# Altium schematic sheet Power.SchDoc: Power
size A3; Date: JUN 2020; ApprovedBy: Hören; CheckedBy: Mörz; Author: Hören; DrawnBy: Rudziński; Engineer: Hören; Organization: Semi-ATE; SheetNumber: 2; SheetTotal: 7
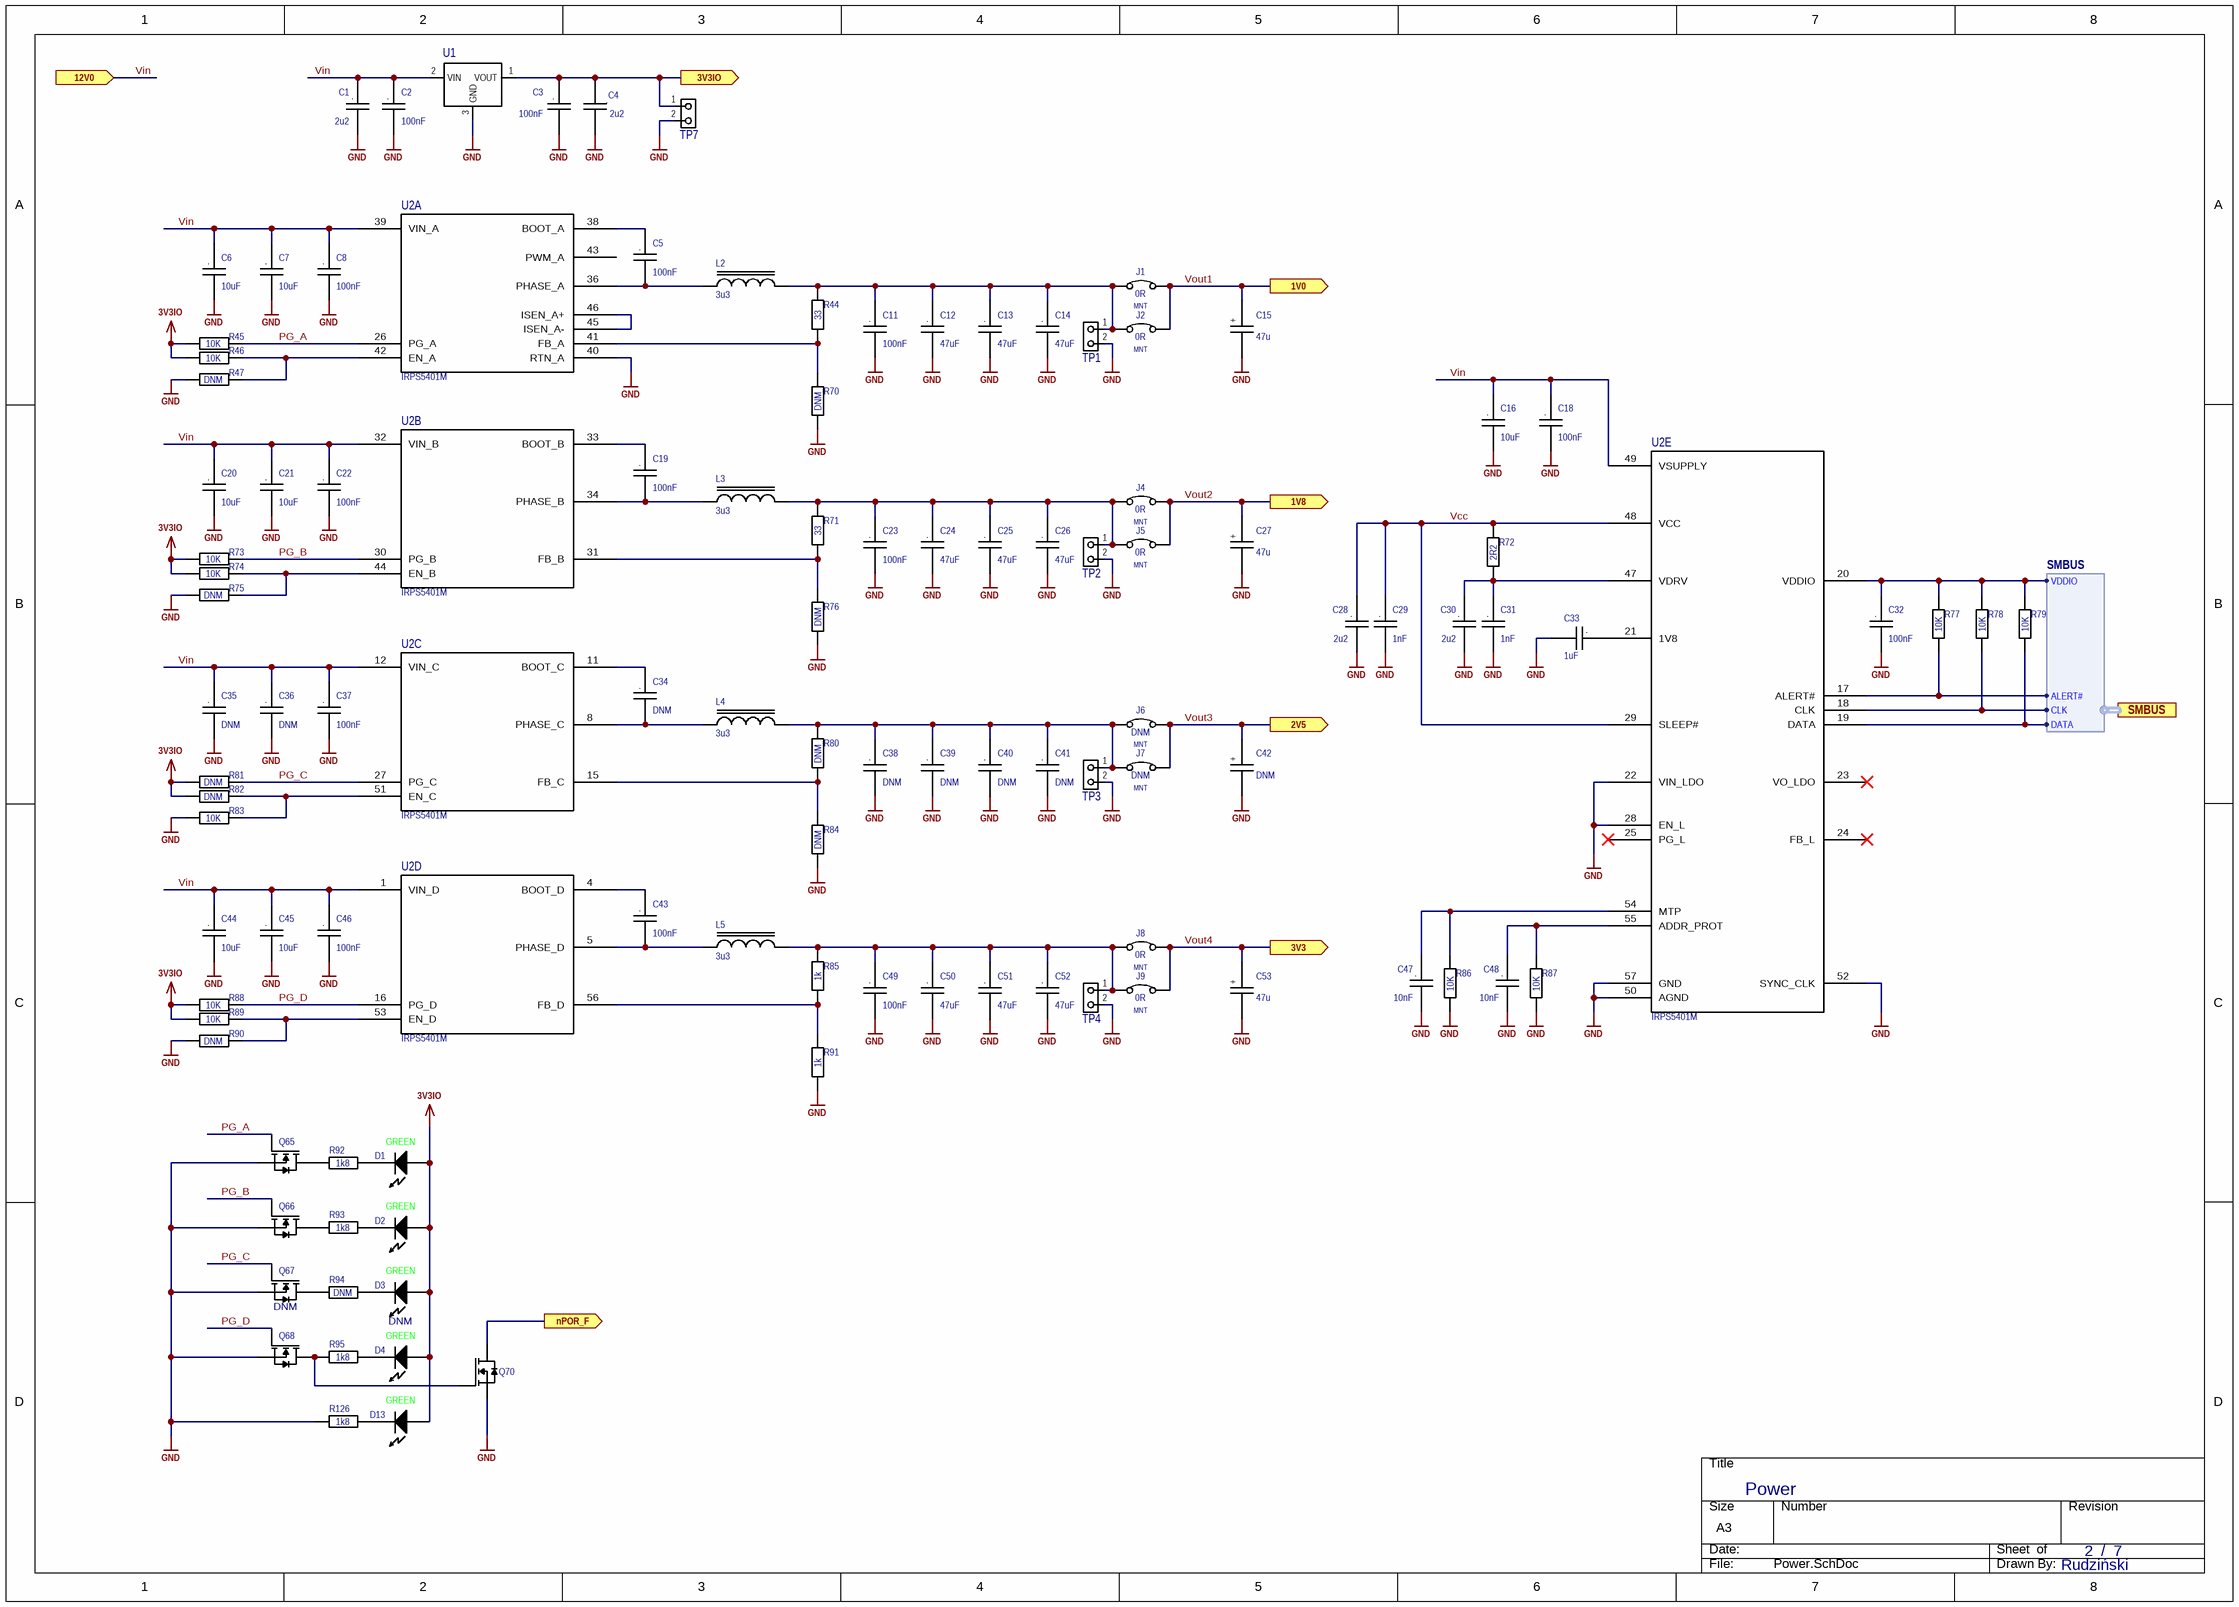
[diagram p0: Power.SchDoc]

## Parts
C1  value 2u2  [C0805 Reflow]  (hidden comment: C)
C2  value 100nF  [C0402 Reflow]  (hidden comment: C)
C3  value 100nF  [C0402 Reflow]  (hidden comment: C)
C4  value 2u2  [C0805 Reflow]  (hidden comment: C)
C5  value 100nF  [C0402 Reflow]  (hidden comment: C)
C6  value 10uF  [C1206 Reflow]  (hidden comment: C)
C7  value 10uF  [C1206 Reflow]  (hidden comment: C)
C8  value 100nF  [C0402 Reflow]  (hidden comment: C)
C11  value 100nF  [C0402 Reflow]  (hidden comment: C)
C12  value 47uF  [C1210 Reflow]  (hidden comment: C)
C13  value 47uF  [C1210 Reflow]  (hidden comment: C)
C14  value 47uF  [C1210 Reflow]  (hidden comment: C)
C15  value 47u  [CAP_TAN_B]  (hidden comment: C+)
C16  value 10uF  [C1206 Reflow]  (hidden comment: C)
C18  value 100nF  [C0402 Reflow]  (hidden comment: C)
C19  value 100nF  [C0402 Reflow]  (hidden comment: C)
C20  value 10uF  [C1206 Reflow]  (hidden comment: C)
C21  value 10uF  [C1206 Reflow]  (hidden comment: C)
C22  value 100nF  [C0402 Reflow]  (hidden comment: C)
C23  value 100nF  [C0402 Reflow]  (hidden comment: C)
C24  value 47uF  [C1210 Reflow]  (hidden comment: C)
C25  value 47uF  [C1210 Reflow]  (hidden comment: C)
C26  value 47uF  [C1210 Reflow]  (hidden comment: C)
C27  value 47u  [CAP_TAN_B]  (hidden comment: C+)
C28  value 2u2  [C0805 Reflow]  (hidden comment: C)
C29  value 1nF  [C0402 Reflow]  (hidden comment: C)
C30  value 2u2  [C0805 Reflow]  (hidden comment: C)
C31  value 1nF  [C0402 Reflow]  (hidden comment: C)
C32  value 100nF  [C0402 Reflow]  (hidden comment: C)
C33  value 1uF  [C0402 Reflow]  (hidden comment: C)
C34  value DNM  [C0402 Reflow]  (hidden comment: C)  (no BOM)
C35  value DNM  [C1206 Reflow]  (hidden comment: C)  (no BOM)
C36  value DNM  [C1206 Reflow]  (hidden comment: C)  (no BOM)
C37  value 100nF  [C0402 Reflow]  (hidden comment: C)
C38  value DNM  [C0402 Reflow]  (hidden comment: C)  (no BOM)
C39  value DNM  [C1210 Reflow]  (hidden comment: C)  (no BOM)
C40  value DNM  [C1210 Reflow]  (hidden comment: C)  (no BOM)
C41  value DNM  [C1210 Reflow]  (hidden comment: C)  (no BOM)
C42  value DNM  [CAP_TAN_B]  (hidden comment: C+)  (no BOM)
C43  value 100nF  [C0402 Reflow]  (hidden comment: C)
C44  value 10uF  [C1206 Reflow]  (hidden comment: C)
C45  value 10uF  [C1206 Reflow]  (hidden comment: C)
C46  value 100nF  [C0402 Reflow]  (hidden comment: C)
C47  value 10nF  [C0402 Reflow]  (hidden comment: C)
C48  value 10nF  [C0402 Reflow]  (hidden comment: C)
C49  value 100nF  [C0402 Reflow]  (hidden comment: C)
C50  value 47uF  [C1210 Reflow]  (hidden comment: C)
C51  value 47uF  [C1210 Reflow]  (hidden comment: C)
C52  value 47uF  [C1210 Reflow]  (hidden comment: C)
C53  value 47u  [CAP_TAN_B]  (hidden comment: C+)
D1  Color: GREEN  [L0603G]  (hidden comment: D)
D2  Color: GREEN  [L0603G]  (hidden comment: D)
D3  Color: GREEN  NicName: DNM  [L0603G]  (hidden comment: D)  (no BOM)
D4  Color: GREEN  [L0603G]  (hidden comment: D)
D13  Color: GREEN  [L0603G]  (hidden comment: D)
J1  value 0R  POPULATED: MNT  [JumperSMD]  (hidden comment: J)  (no BOM)
J2  value 0R  POPULATED: MNT  [JumperSMD]  (hidden comment: J)  (no BOM)
J4  value 0R  POPULATED: MNT  [JumperSMD]  (hidden comment: J)  (no BOM)
J5  value 0R  POPULATED: MNT  [JumperSMD]  (hidden comment: J)  (no BOM)
J6  value DNM  POPULATED: MNT  [JumperSMD]  (hidden comment: J)  (no BOM)
J7  value DNM  POPULATED: MNT  [JumperSMD]  (hidden comment: J)  (no BOM)
J8  value 0R  POPULATED: MNT  [JumperSMD]  (hidden comment: J)  (no BOM)
J9  value 0R  POPULATED: MNT  [JumperSMD]  (hidden comment: J)  (no BOM)
L2  Inductance: 3u3  [XAL4030]  (hidden comment: L)
L3  Inductance: 3u3  [XAL4030]  (hidden comment: L)
L4  Inductance: 3u3  [XAL4030]  (hidden comment: L)  (no BOM)
L5  Inductance: 3u3  [XAL4030]  (hidden comment: L)
Q65  Q  [SOT23-3]  (value not drawn)
Q66  Q  [SOT23-3]  (value not drawn)
Q67  NicName: DNM  [SOT23-3]  (hidden comment: Q)  (no BOM)
Q68  Q  [SOT23-3]  (value not drawn)
Q70  Q  [SOT23-3]  (value not drawn)
R44  value 33  [R0402 Reflow]  (hidden comment: R)
R45  value 10K  [R0402 Reflow]  (hidden comment: R)
R46  value 10K  [R0402 Reflow]  (hidden comment: R)
R47  value DNM  [R0402 Reflow]  (hidden comment: R)  (no BOM)
R70  value DNM  [R0402 Reflow]  (hidden comment: R)  (no BOM)
R71  value 33  [R0402 Reflow]  (hidden comment: R)
R72  value 2R2  [R0402 Reflow]  (hidden comment: R)
R73  value 10K  [R0402 Reflow]  (hidden comment: R)
R74  value 10K  [R0402 Reflow]  (hidden comment: R)
R75  value DNM  [R0402 Reflow]  (hidden comment: R)  (no BOM)
R76  value DNM  [R0402 Reflow]  (hidden comment: R)  (no BOM)
R77  value 10K  [R0402 Reflow]  (hidden comment: R)
R78  value 10K  [R0402 Reflow]  (hidden comment: R)
R79  value 10K  [R0402 Reflow]  (hidden comment: R)
R80  value DNM  [R0402 Reflow]  (hidden comment: R)  (no BOM)
R81  value DNM  [R0402 Reflow]  (hidden comment: R)  (no BOM)
R82  value DNM  [R0402 Reflow]  (hidden comment: R)  (no BOM)
R83  value 10K  [R0402 Reflow]  (hidden comment: R)
R84  value DNM  [R0402 Reflow]  (hidden comment: R)  (no BOM)
R85  value 1k  [R0402 Reflow]  (hidden comment: R)
R86  value 10K  [R0402 Reflow]  (hidden comment: R)
R87  value 10K  [R0402 Reflow]  (hidden comment: R)
R88  value 10K  [R0402 Reflow]  (hidden comment: R)
R89  value 10K  [R0402 Reflow]  (hidden comment: R)
R90  value DNM  [R0402 Reflow]  (hidden comment: R)  (no BOM)
R91  value 1k  [R0402 Reflow]  (hidden comment: R)
R92  value 1k8  [R0603 Reflow]  (hidden comment: R)
R93  value 1k8  [R0603 Reflow]  (hidden comment: R)
R94  value DNM  [R0603 Reflow]  (hidden comment: R)  (no BOM)
R95  value 1k8  [R0603 Reflow]  (hidden comment: R)
R126  value 1k8  [R0603 Reflow]  (hidden comment: R)
TP1  TP  [DualTestpoint 100mils]  (value not drawn)  (no BOM)
TP2  TP  [DualTestpoint 100mils]  (value not drawn)  (no BOM)
TP3  TP  [DualTestpoint 100mils]  (value not drawn)  (no BOM)
TP4  TP  [DualTestpoint 100mils]  (value not drawn)  (no BOM)
TP7  TP  [DualTestpoint 100mils]  (value not drawn)  (no BOM)
U1  U  [SOT23-3]  (value not drawn)
U2  IRPS5401M  [QFN4-7x7-56_IRPS5401M]  (parts A,B,C,D,E of 5)

## Ports
1V0 (out), 1V8 (out), 2V5 (out), 3V3 (out), 3V3IO (out), 12V0 (in), nPOR_F (out), SMBUS (harness SMBUS)

## Harnesses
SMBUS: ALERT#, CLK, DATA, VDDIO

## Nets
3V3IO: D1.1(Anode) D2.1(Anode) D3.1(Anode) D4.1(Anode) D13.1(Anode) R45.2 R46.2 R73.2 R74.2 R81.2 R82.2 R88.2 R89.2
GND: C1.2 C2.2 C3.2 C4.2 C6.2 C7.2 C8.2 C11.2 C12.2 C13.2 C14.2 C15.2 C16.2 C18.2 C20.2 C21.2 C22.2 C23.2 C24.2 C25.2 C26.2 C27.2 C28.2 C29.2 C30.2 C31.2 C32.2 C33.2 C35.2 C36.2 C37.2 C38.2 C39.2 C40.2 C41.2 C42.2 C44.2 C45.2 C46.2 C47.2 C48.2 C49.2 C50.2 C51.2 C52.2 C53.2 Q65.2(S) Q66.2(S) Q67.2(S) Q68.2(S) Q70.2(S) R47.2 R70.1 R75.2 R76.1 R83.2 R84.1 R86.1 R87.1 R90.2 R91.1 R126.1 TP1.2 TP2.2 TP3.2 TP4.2 TP7.2 U1.3(GND) U2.22(VIN_LDO) U2.28(EN_L) U2.40(RTN_A) U2.50(AGND) U2.52(SYNC_CLK) U2.57(GND)
3V3IO: C3.1 C4.1 TP7.1 U1.1(VOUT) ; port 3V3IO  [a separate net that carries the same name]
nPOR_F: Q70.3(D) ; port nPOR_F
PG_A: Q65.1(G) R45.1 U2.26(PG_A)
PG_B: Q66.1(G) R73.1 U2.30(PG_B)
PG_C: Q67.1(G) R81.1 U2.27(PG_C)
PG_D: Q68.1(G) R88.1 U2.16(PG_D)
Vcc: C28.1 C29.1 R72.2 U2.29(SLEEP#) U2.48(VCC)
Vin: C1.1 C2.1 C6.1 C7.1 C8.1 C16.1 C18.1 C20.1 C21.1 C22.1 C35.1 C36.1 C37.1 C44.1 C45.1 C46.1 U1.2(VIN) U2.1(VIN_D) U2.12(VIN_C) U2.32(VIN_B) U2.39(VIN_A) U2.49(VSUPPLY) ; port 12V0
Vout1: C15.1 J1.2 J2.2 ; port 1V0
Vout2: C27.1 J4.2 J5.2 ; port 1V8
Vout3: C42.1 J6.2 J7.2 ; port 2V5
Vout4: C53.1 J8.2 J9.2 ; port 3V3
NetC5_1: C5.1 U2.38(BOOT_A)
NetC5_2: C5.2 L2.1 U2.36(PHASE_A)
NetC11_1: C11.1 C12.1 C13.1 C14.1 J1.1 J2.1 L2.2 R44.2 TP1.1
NetC19_1: C19.1 U2.33(BOOT_B)
NetC19_2: C19.2 L3.1 U2.34(PHASE_B)
NetC23_1: C23.1 C24.1 C25.1 C26.1 J4.1 J5.1 L3.2 R71.2 TP2.1
NetC30_1: C30.1 C31.1 R72.1 U2.47(VDRV)
NetC32_1: C32.1 R77.2 R78.2 R79.2 U2.20(VDDIO) ; port SMBUS.VDDIO
NetC33_1: C33.1 U2.21(1V8)
NetC34_1: C34.1 U2.11(BOOT_C)
NetC34_2: C34.2 L4.1 U2.8(PHASE_C)
NetC38_1: C38.1 C39.1 C40.1 C41.1 J6.1 J7.1 L4.2 R80.2 TP3.1
NetC43_1: C43.1 U2.4(BOOT_D)
NetC43_2: C43.2 L5.1 U2.5(PHASE_D)
NetC47_1: C47.1 R86.2 U2.54(MTP)
NetC48_1: C48.1 R87.2 U2.55(ADDR_PROT)
NetC49_1: C49.1 C50.1 C51.1 C52.1 J8.1 J9.1 L5.2 R85.2 TP4.1
NetD1_2: D1.2(Cathode) R92.2
NetD2_2: D2.2(Cathode) R93.2
NetD3_2: D3.2(Cathode) R94.2
NetD4_2: D4.2(Cathode) R95.2
NetD13_2: D13.2(Cathode) R126.2
NetQ65_3: Q65.3(D) R92.1
NetQ66_3: Q66.3(D) R93.1
NetQ67_3: Q67.3(D) R94.1
NetQ68_3: Q68.3(D) Q70.1(G) R95.1
NetR44_1: R44.1 R70.2 U2.41(FB_A)
NetR46_1: R46.1 R47.1 U2.42(EN_A)
NetR71_1: R71.1 R76.2 U2.31(FB_B)
NetR74_1: R74.1 R75.1 U2.44(EN_B)
NetR77_1: R77.1 U2.17(ALERT#) ; port SMBUS.ALERT#
NetR78_1: R78.1 U2.18(CLK) ; port SMBUS.CLK
NetR79_1: R79.1 U2.19(DATA) ; port SMBUS.DATA
NetR80_1: R80.1 R84.2 U2.15(FB_C)
NetR82_1: R82.1 R83.1 U2.51(EN_C)
NetR85_1: R85.1 R91.2 U2.56(FB_D)
NetR89_1: R89.1 R90.1 U2.53(EN_D)
NetU2_45: U2.45(ISEN_A-) U2.46(ISEN_A+)

Not connected (* = marked no-connect by the designer): U2 23(VO_LDO)* 24(FB_L)* 25(PG_L)* 43(PWM_A)

## Notes on the sheet
- /
- designed by
- reviewed by
- last drawn by
- Project:
- Schematic:
- last printed
- DIN-A3 L
- sheets
- of
- File:
- (in symbol C) .
- (in symbol C+_TAN) +
- (in symbol C_2) .
- (in symbol C_7) .
- (in symbol C_10) .
- (in symbol C_11) .

## Library data of the parts
C1 C4 C28 C30 = C_11: CAP CER 2.2UF 10V X7R 0805; 04. Manufacturer: Samsung Electro-Mechanics; 07. Manufacturer  Part Number: CL21B225KPFNNNE; Tolerance: ±10%; 03. Unit Price: 0.11; Voltage Rating: 10V; Type: X7R; ComponentLink1Description: Info; ComponentLink1URL: https://www.digikey.de/product-detail/en/kemet/C0805C225K8RACTU/399-3522-6-ND/1787578; 02. Distributor Part Number: 1276-1188-1-ND; 09. Operating Temperature: -55°C ~ 125°C; 11. RoHS: YES; 01. Distributor: DigiKey; ComponentLink2Description: DataSheet; ComponentLink2URL: https://content.kemet.com/datasheets/KEM_C1002_X7R_SMD.pdf; Package: 0805
C2 C3 C5 C8 C11 C18 C19 C22 C23 C32 C34 C37 C38 C43 C46 C49 = C: CAP CER 0.1UF 25V X7R 0402; 04. Manufacturer: Yageo; 07. Manufacturer  Part Number: CC0402KRX7R8BB104; Tolerance: ±10%; 03. Unit Price: 0.09; 13. Created Date/Name: AUG2018/Hören; Voltage Rating: 25V; Type: X7R; ComponentLink1Description: Info; ComponentLink1URL: https://www.digikey.de/products/en?keywords=311-2077-6-ND; 02. Distributor Part Number: 311-2077-6-ND; 09. Operating Temperature: -55°C ~ 125°C; 11. RoHS: YES; 01. Distributor: DigiKey; ComponentLink2Description: DataSheet; Package: 0402
C6 C7 C16 C20 C21 C35 C36 C44 C45 = C: CAP CER 10UF 25V X7R 1206; 04. Manufacturer: TDK Corporation; 07. Manufacturer  Part Number: C3216X7R1E106K160AB; Tolerance: ±10%; 03. Unit Price: 0.66; 13. Created Date/Name: AUG2018/Hören; Voltage Rating: 25V; Type: X7R; ComponentLink1Description: Info; ComponentLink1URL: https://www.digikey.de/products/en?keywords=445-7705-6-ND; 02. Distributor Part Number: 445-7705-6-ND; 09. Operating Temperature: -55°C ~ 125°C; 11. RoHS: YES; 01. Distributor: DigiKey; ComponentLink2Description: DataSheet; Package: 1206
C12-C14 C24-C26 C39-C41 C50-C52 = C: CAP CER 47UF 10V X5R 1210; 04. Manufacturer: Samsung Electro-Mechanics; 07. Manufacturer  Part Number: CL32A476MPJNNNE; Tolerance: ±20%; 03. Unit Price: 0.88; 13. Created Date/Name: AUG2018/Hören; Voltage Rating: 10V; Type: X5R; ComponentLink1Description: Info; ComponentLink1URL: *; 02. Distributor Part Number: 1276-3380-6-ND; 09. Operating Temperature: -55°C ~ 85°C; 11. RoHS: YES; 01. Distributor: DigiKey; ComponentLink2Description: DataSheet; Package: 1210
C15 C27 C42 C53 = C+_TAN: CAP TANT 47UF 20% 10V 1411; 04. Manufacturer: AVX Corporation; 07. Manufacturer  Part Number: F971A476MBAHT3; 03. Unit Price: 0.73; 3D-Export: No; ComponentLink1Description: Info; 02. Distributor Part Number: 478-12531-1-ND; 11. RoHS: YES; 01. Distributor: DigiKey; ComponentLink2Description: DataSheet
C29 C31 = C_7: CAP CER 1000PF 25V X7R 0402; 04. Manufacturer: KEMET; 07. Manufacturer  Part Number: C0402C102K3RACTU; Tolerance: ±10%; 03. Unit Price: 0.09; 13. Created Date/Name: AUG2018/Hören; Voltage Rating: 25V; Type: X7R; ComponentLink1Description: Info; ComponentLink1URL: https://www.digikey.de/products/en?keywords=399-1031-6-ND; 02. Distributor Part Number: 399-1031-6-ND; 09. Operating Temperature: -55°C ~ 125°C; 11. RoHS: YES; 01. Distributor: DigiKey; ComponentLink2Description: DataSheet; Package: 0402
C33 = C_2: CAP CER 1UF 6.3V X7R 0402; 04. Manufacturer: Murata Electronics; 07. Manufacturer  Part Number: GRM155R70J105KA12J; Tolerance: ±10%; 03. Unit Price: 0.11; 13. Created Date/Name: AUG2018/Hören; Voltage Rating: 6.3V; Type: X7R; ComponentLink1Description: Info; ComponentLink1URL: https://www.digikey.de/product-detail/en/murata-electronics/GRM155R70J105KA12J/490-13339-6-ND/5973468; 02. Distributor Part Number: 490-13339-6-ND; 09. Operating Temperature: -55°C ~ 125°C; 11. RoHS: YES; 01. Distributor: DigiKey; ComponentLink2Description: DataSheet; Package: 0402
C47 C48 = C_10: CAP CER 0.01UF 25V X7R 0402; 04. Manufacturer: Murata Electronics; 07. Manufacturer  Part Number: GCM155R71E103KA37D; Tolerance: ±10%; 03. Unit Price: 0.09; Voltage Rating: 25V; Type: X7R; ComponentLink1Description: Info; ComponentLink1URL: https://www.digikey.de/product-detail/en/murata-electronics/GCM155R71E103KA37D/490-6043-6-ND/3846259; 02. Distributor Part Number: 490-6043-6-ND; 09. Operating Temperature: -55°C ~ 125°C; 11. RoHS: YES; 01. Distributor: DigiKey; ComponentLink2Description: DataSheet; Package: 0402
D1-D4 D13 = LED: LED GREEN DIFFUSED 0603 SMD; 04. Manufacturer: OSRAM Opto Semiconductors Inc.; 07. Manufacturer  Part Number: LG L29K-G2J1-24-Z; Vf: 1.7V; If: 2mA; Wave Length: 570nm; Viewing Angle: 160°; 03. Unit Price: 0.4; 13. Created Date/Name: AUG2018/Hören; ComponentLink1Description: Info; ComponentLink1URL: https://www.digikey.de/products/en?keywords=475-2709-6-ND; ComponentLink2Description: DataSheet; ComponentLink2URL: https://www.digikey.de/products/en?keywords=475-2709-6-ND; 02. Distributor Part Number: 475-2709-6-ND; 11. RoHS: YES; 01. Distributor: DigiKey
J1 J2 J4-J9 = Jumper SMD: RES SMD 0 OHM JUMPER 1/10W 0603; 04. Manufacturer: Yageo; 07. Manufacturer  Part Number: RC0603JR-070RL; 03. Unit Price: 0.09; 01. Distributor: DigiKey; 02. Distributor Part Number: 311-0.0GRDKR-ND; 09. Operating Temperature: -55°C ~ 155°C; 11. RoHS: YES; Package: 0603; ComponentLink4Description: Info; ComponentLink4URL: https://www.digikey.de/product-detail/en/yageo/RC0603JR-070RL/311-0.0GRDKR-ND/732569; ComponentLink5Description: DataSheet; ComponentLink5URL: http://www.yageo.com/documents/recent/PYu-RC_Group_51_RoHS_L_10.pdf
L2 L3 L5 = INDUCTOR: Fixed Inductors 3.3uH Shld 20% 6.6A 28.6mOhms AECQ2; 04. Manufacturer: Coilcraft; 07. Manufacturer  Part Number: XAL4030-332MEC; Impedance Tolerance: %; 03. Unit Price: 1.95; ComponentLink1Description: Info; ComponentLink1URL: https://www.digikey.de/products/en?keywords=732-1620-6-ND; ComponentLink2Description: DataSheet; ComponentLink2URL: https://www.we-online.de/katalog/datasheet/742792040.pdf; 02. Distributor Part Number: 994-XAL4030-332MEC; 11. RoHS: YES; Tolerance: *; Value: *; 01. Distributor: Mouser
L4 = INDUCTOR: Fixed Inductors 3.3uH Shld 20% 6.6A 28.6mOhms AECQ2; 04. Manufacturer: Coilcraft; 07. Manufacturer  Part Number: XAL4030-332MEC; Impedance Tolerance: %; 03. Unit Price: 1.95; Value: DNM; ComponentLink1Description: Info; ComponentLink1URL: https://www.digikey.de/products/en?keywords=732-1620-6-ND; ComponentLink2Description: DataSheet; ComponentLink2URL: https://www.we-online.de/katalog/datasheet/742792040.pdf; 02. Distributor Part Number: 994-XAL4030-332MEC; 11. RoHS: YES; Tolerance: *; 01. Distributor: Mouser
Q65-Q68 Q70 = FDV303N: MOSFET N-CH 25V 680MA SOT-23; 04. Manufacturer: ON Semiconductor; 03. Unit Price: 0.41; 13. Created Date/Name: AUG 2018 / Hören; Rds On: 450 mΩ @ id=500mA & Vgs=4.5V; Vgs,th: 1.5V @ 250uA; Power Rating: 350mW; 3D-Export: No; 01. Distributor: DigiKey; 02. Distributor Part Number: FDV303NDKR-ND; 07. Manufacturer  Part Number: FDV303N; 09. Operating Temperature: -55°C ~ 150°C (TJ); 11. RoHS: YES; ComponentLink1Description: Info; ComponentLink1URL: https://www.digikey.de/product-detail/en/on-semiconductor/FDV303N/FDV303NDKR-ND/1630434; ComponentLink2Description: DataSheet; ComponentLink2URL: https://media.digikey.com/pdf/Data%20Sheets/Fairchild%20PDFs/FDV303N.pdf; Vdss: 25V; Id: 680mA
R44 R71 = R: RES SMD 33 OHM 1% 1/16W 0402; 04. Manufacturer: Yageo; 07. Manufacturer  Part Number: RC0402FR-0733RL; 03. Unit Price: 0.09; 13. Created Date/Name: AUG2018/Hören; Power Rating: 63mW; Tolerance: ±1%; ComponentLink1URL: https://www.digikey.de/products/en?keywords=311-10.0KLRDKR-ND; ComponentLink1Description: Info; 02. Distributor Part Number: 311-33.0LRDKR-ND; 09. Operating Temperature: -55°C ~ 155°C; 11. RoHS: YES; 01. Distributor: DigiKey; ComponentLink2Description: DataSheet; Type: Thick Film; Package: 0402
R45-R47 R70 R73-R84 R86-R90 = R: RES SMD 10K OHM 1% 1/16W 0402; 04. Manufacturer: Yageo; 07. Manufacturer  Part Number: RC0402FR-0710KL; 03. Unit Price: 0.09; 13. Created Date/Name: AUG2018/Hören; Power Rating: 63mW; Tolerance: ±1%; ComponentLink1URL: https://www.digikey.de/products/en?keywords=311-10.0KLRDKR-ND; ComponentLink1Description: Info; 02. Distributor Part Number: 311-10.0KLRDKR-ND; 09. Operating Temperature: -55°C ~ 155°C; 11. RoHS: YES; 01. Distributor: DigiKey; ComponentLink2Description: DataSheet; Type: Thick Film; Package: 0402
R72 = R_24: RES SMD 2.2 OHM 1% 1/10W 0402; 04. Manufacturer: Yageo; 07. Manufacturer  Part Number: RC0402FR-072R2L; 03. Unit Price: 0.09; Power Rating: 0.1W; Tolerance: ±1%; ComponentLink1URL: https://www.digikey.de/product-detail/en/panasonic-electronic-components/ERJ-2RKF15R0X/P15.0LDKR-ND/575530; ComponentLink1Description: Info; 02. Distributor Part Number: 311-2.20LRTR-ND; 11. RoHS: YES; 01. Distributor: DigiKey; ComponentLink2Description: DataSheet; ComponentLink2URL: https://industrial.panasonic.com/cdbs/www-data/pdf/RDA0000/AOA0000C304.pdf; Package: 0402
R85 R91 = R: RES SMD 1K OHM 1% 1/16W 0402; 04. Manufacturer: Yageo; 07. Manufacturer  Part Number: RC0402FR-071KP; 03. Unit Price: 0.09; 13. Created Date/Name: AUG2018/Hören; Power Rating: 63mW; Tolerance: ±1%; ComponentLink1URL: https://www.digikey.de/products/en?keywords=311-10.0KLRDKR-ND; ComponentLink1Description: Info; 02. Distributor Part Number: YAG1254CT-ND; 09. Operating Temperature: -55°C ~ 155°C; 11. RoHS: YES; 01. Distributor: DigiKey; ComponentLink2Description: DataSheet; Type: Thick Film; Package: 0402
R92 R93 R95 R126 = R: RES SMD 1.8K OHM 1% 1/16W 0402; 04. Manufacturer: Yageo; 07. Manufacturer  Part Number: RC0402FR-071K8L; 03. Unit Price: 0.09; 13. Created Date/Name: AUG2018/Hören; Power Rating: 63mW; Tolerance: ±1%; ComponentLink1URL: https://www.digikey.de/product-detail/en/yageo/RC0402FR-071K65L/YAG3043DKR-ND/5282914; ComponentLink1Description: Info; 02. Distributor Part Number: 311-1.80KLRCT-ND; 09. Operating Temperature: -55°C ~ 155°C; 11. RoHS: YES; 01. Distributor: DigiKey; ComponentLink2Description: DataSheet; Type: Thick Film; Package: 0402
R94 = R: RES SMD 1.65K OHM 1% 1/16W 0402; 04. Manufacturer: Yageo; 07. Manufacturer  Part Number: RC0402FR-071K65L; 03. Unit Price: 0.09; 13. Created Date/Name: AUG2018/Hören; Power Rating: 63mW; Tolerance: ±1%; ComponentLink1URL: https://www.digikey.de/product-detail/en/yageo/RC0402FR-071K65L/YAG3043DKR-ND/5282914; ComponentLink1Description: Info; 02. Distributor Part Number: YAG3043DKR-ND; 09. Operating Temperature: -55°C ~ 155°C; 11. RoHS: YES; 01. Distributor: DigiKey; ComponentLink2Description: DataSheet; Type: Thick Film; Package: 0402
TP1-TP4 TP7 = DualTestpoint 100mils: Dual testpoint, pitch 2.54mm; 04. Manufacturer: Samtec Inc.; 07. Manufacturer  Part Number: HMTSW-103-07-G-S-240; 03. Unit Price: 0.25; 13. Created Date/Name: AUG2018/Hören; 01. Distributor: Samtec Inc.; 02. Distributor Part Number: HMTSW-103-07-G-S-240; 11. RoHS: YES; ComponentLink1Description: Info; ComponentLink1URL: https://www.samtec.com/products/hmtsw-103-07-g-s-240; ComponentLink2Description: DataSheet; ComponentLink2URL: http://suddendocs.samtec.com/catalog_english/hmtsw.pdf
U1 = ZMR330FTA: IC REG LINEAR 3.3V 50MA SOT23-3; 04. Manufacturer: Diodes Incorporated; 03. Unit Price: 0.83; 01. Distributor: DigiKey; 02. Distributor Part Number: ZMR330FTR-ND; 07. Manufacturer  Part Number: ZMR330FTA; 11. RoHS: YES; ComponentLink1Description: Info; ComponentLink1URL: https://www.digikey.de/product-detail/en/diodes-incorporated/ZMR330FTA/ZMR330FCT-ND/790216; ComponentLink2Description: DataSheet; ComponentLink2URL: https://www.diodes.com/assets/Datasheets/ZMRSERIES.pdf
U2 = IRPS5401M: POL - SUPIRBUCK; MFR-PN: IRPS5401MTRPBF; MFR: Infineon Technologies; 03. Unit Price: 6.99; 04. Manufacturer: Infineon Technologies; 07. Manufacturer  Part Number: IRPS5401MTRPBF; 01. Distributor: DigiKey; 02. Distributor Part Number: IRPS5401MTRPBFCT-ND; 11. RoHS: YES; ComponentLink4Description: Info; ComponentLink4URL: https://www.digikey.de/products/en?keywords=XC7A15T-1CSG324C; ComponentLink5Description: DataSheet; ComponentLink5URL: https://www.xilinx.com/support/documentation/data_sheets/ds181_Artix_7_Data_Sheet.pdf; ComponentLink6Description: NXP; ComponentLink6URL: https://www.nxp.com/part/MK20DN512VMD10; NicName: IRPS5401M